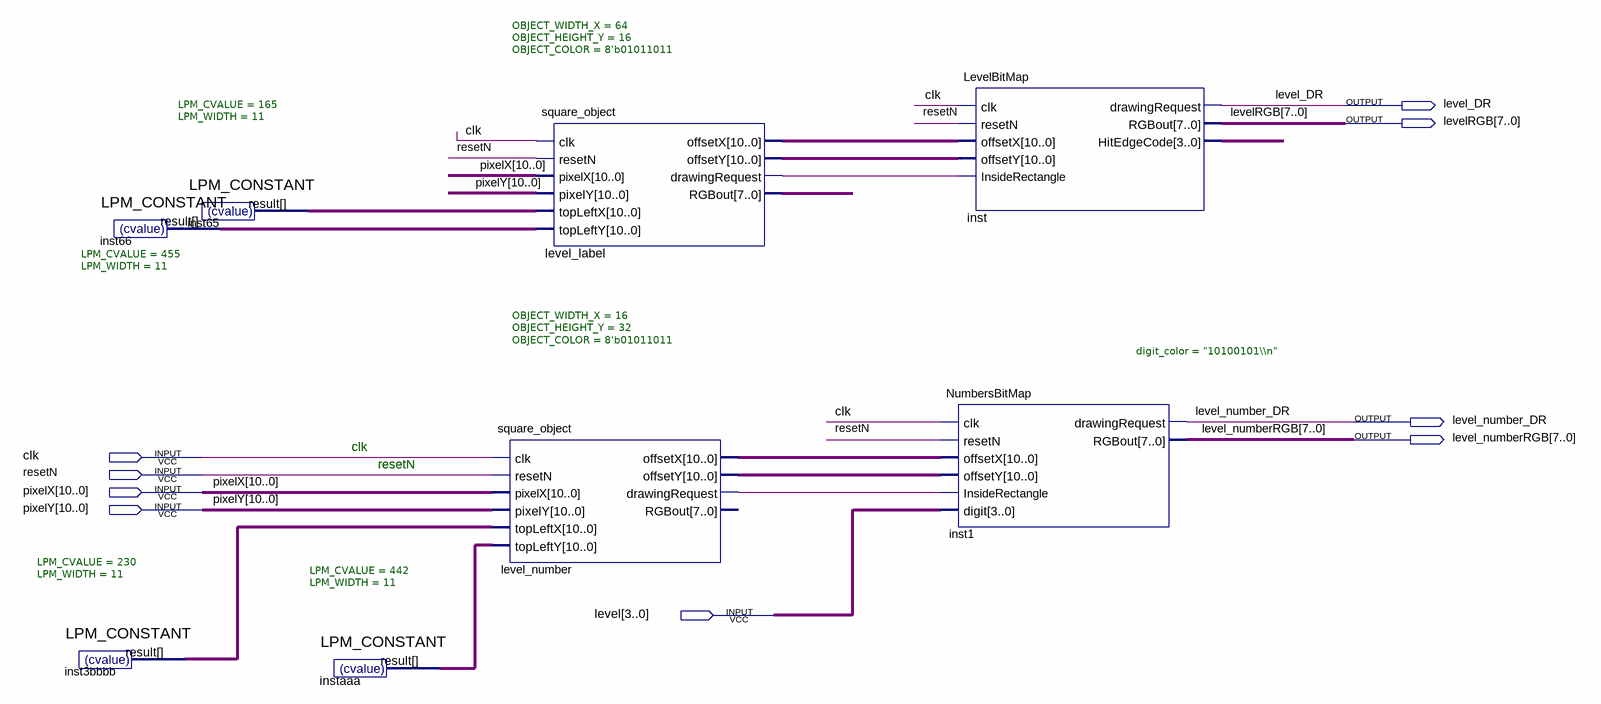
[diagram p0: schematic sheet]
// Quartus schematic Level_label_block.bdf as structural Verilog: 8 symbols, 9 pins
module Level_label_block (
  input  clk,
  input  resetN,
  input  [10:0] pixelX,
  input  [10:0] pixelY,
  input  [3:0] level,
  output level_DR,
  output [7:0] levelRGB,
  output level_number_DR,
  output [7:0] level_numberRGB
);

  wire level_label_drawingrequest, level_number_drawingrequest;
  wire [3:0] inst_hitedgecode;
  wire [7:0] level_label_rgbout;
  wire [10:0] inst3bbbb_result, inst65_result, inst66_result, instaaa_result, level_label_offsetx,
       level_label_offsety, level_number_offsetx, level_number_offsety;

  LPM_CONSTANT #(.LPM_CVALUE(455), .LPM_WIDTH(11)) inst66 (.result(inst66_result));
  LPM_CONSTANT #(.LPM_CVALUE(230), .LPM_WIDTH(11)) inst3bbbb (.result(inst3bbbb_result));
  LPM_CONSTANT #(.LPM_CVALUE(165), .LPM_WIDTH(11)) inst65 (.result(inst65_result));
  LPM_CONSTANT #(.LPM_CVALUE(442), .LPM_WIDTH(11)) instaaa (.result(instaaa_result));
  square_object #(.OBJECT_WIDTH_X(16), .OBJECT_HEIGHT_Y(32), .OBJECT_COLOR(8'b01011011)) level_number (
    .clk(clk), .resetN(resetN), .pixelX(pixelX), .pixelY(pixelY), .topLeftX(inst3bbbb_result),
    .topLeftY(instaaa_result), .offsetX(level_number_offsetx), .offsetY(level_number_offsety),
    .drawingRequest(level_number_drawingrequest));  // open: RGBout
  square_object #(.OBJECT_WIDTH_X(64), .OBJECT_HEIGHT_Y(16), .OBJECT_COLOR(8'b01011011)) level_label (
    .clk(clk), .resetN(resetN), .pixelX(pixelX), .pixelY(pixelY), .topLeftX(inst65_result),
    .topLeftY(inst66_result), .offsetX(level_label_offsetx), .offsetY(level_label_offsety),
    .drawingRequest(level_label_drawingrequest), .RGBout(level_label_rgbout));
  NumbersBitMap #(.digit_color("10100101\\n")) inst1 (
    .clk(clk), .resetN(resetN), .offsetX(level_number_offsetx), .offsetY(level_number_offsety),
    .InsideRectangle(level_number_drawingrequest), .digit(level), .drawingRequest(level_number_DR),
    .RGBout(level_numberRGB));
  LevelBitMap inst (
    .clk(clk), .resetN(resetN), .offsetX(level_label_offsetx), .offsetY(level_label_offsety),
    .InsideRectangle(level_label_drawingrequest), .drawingRequest(level_DR), .RGBout(levelRGB),
    .HitEdgeCode(inst_hitedgecode));

  // Notes on the sheet:
  //   clk
  //   resetN
endmodule
